# Altium schematic sheet Sheet3.SchDoc
size A3; SheetNumber: 1; SheetTotal: 1
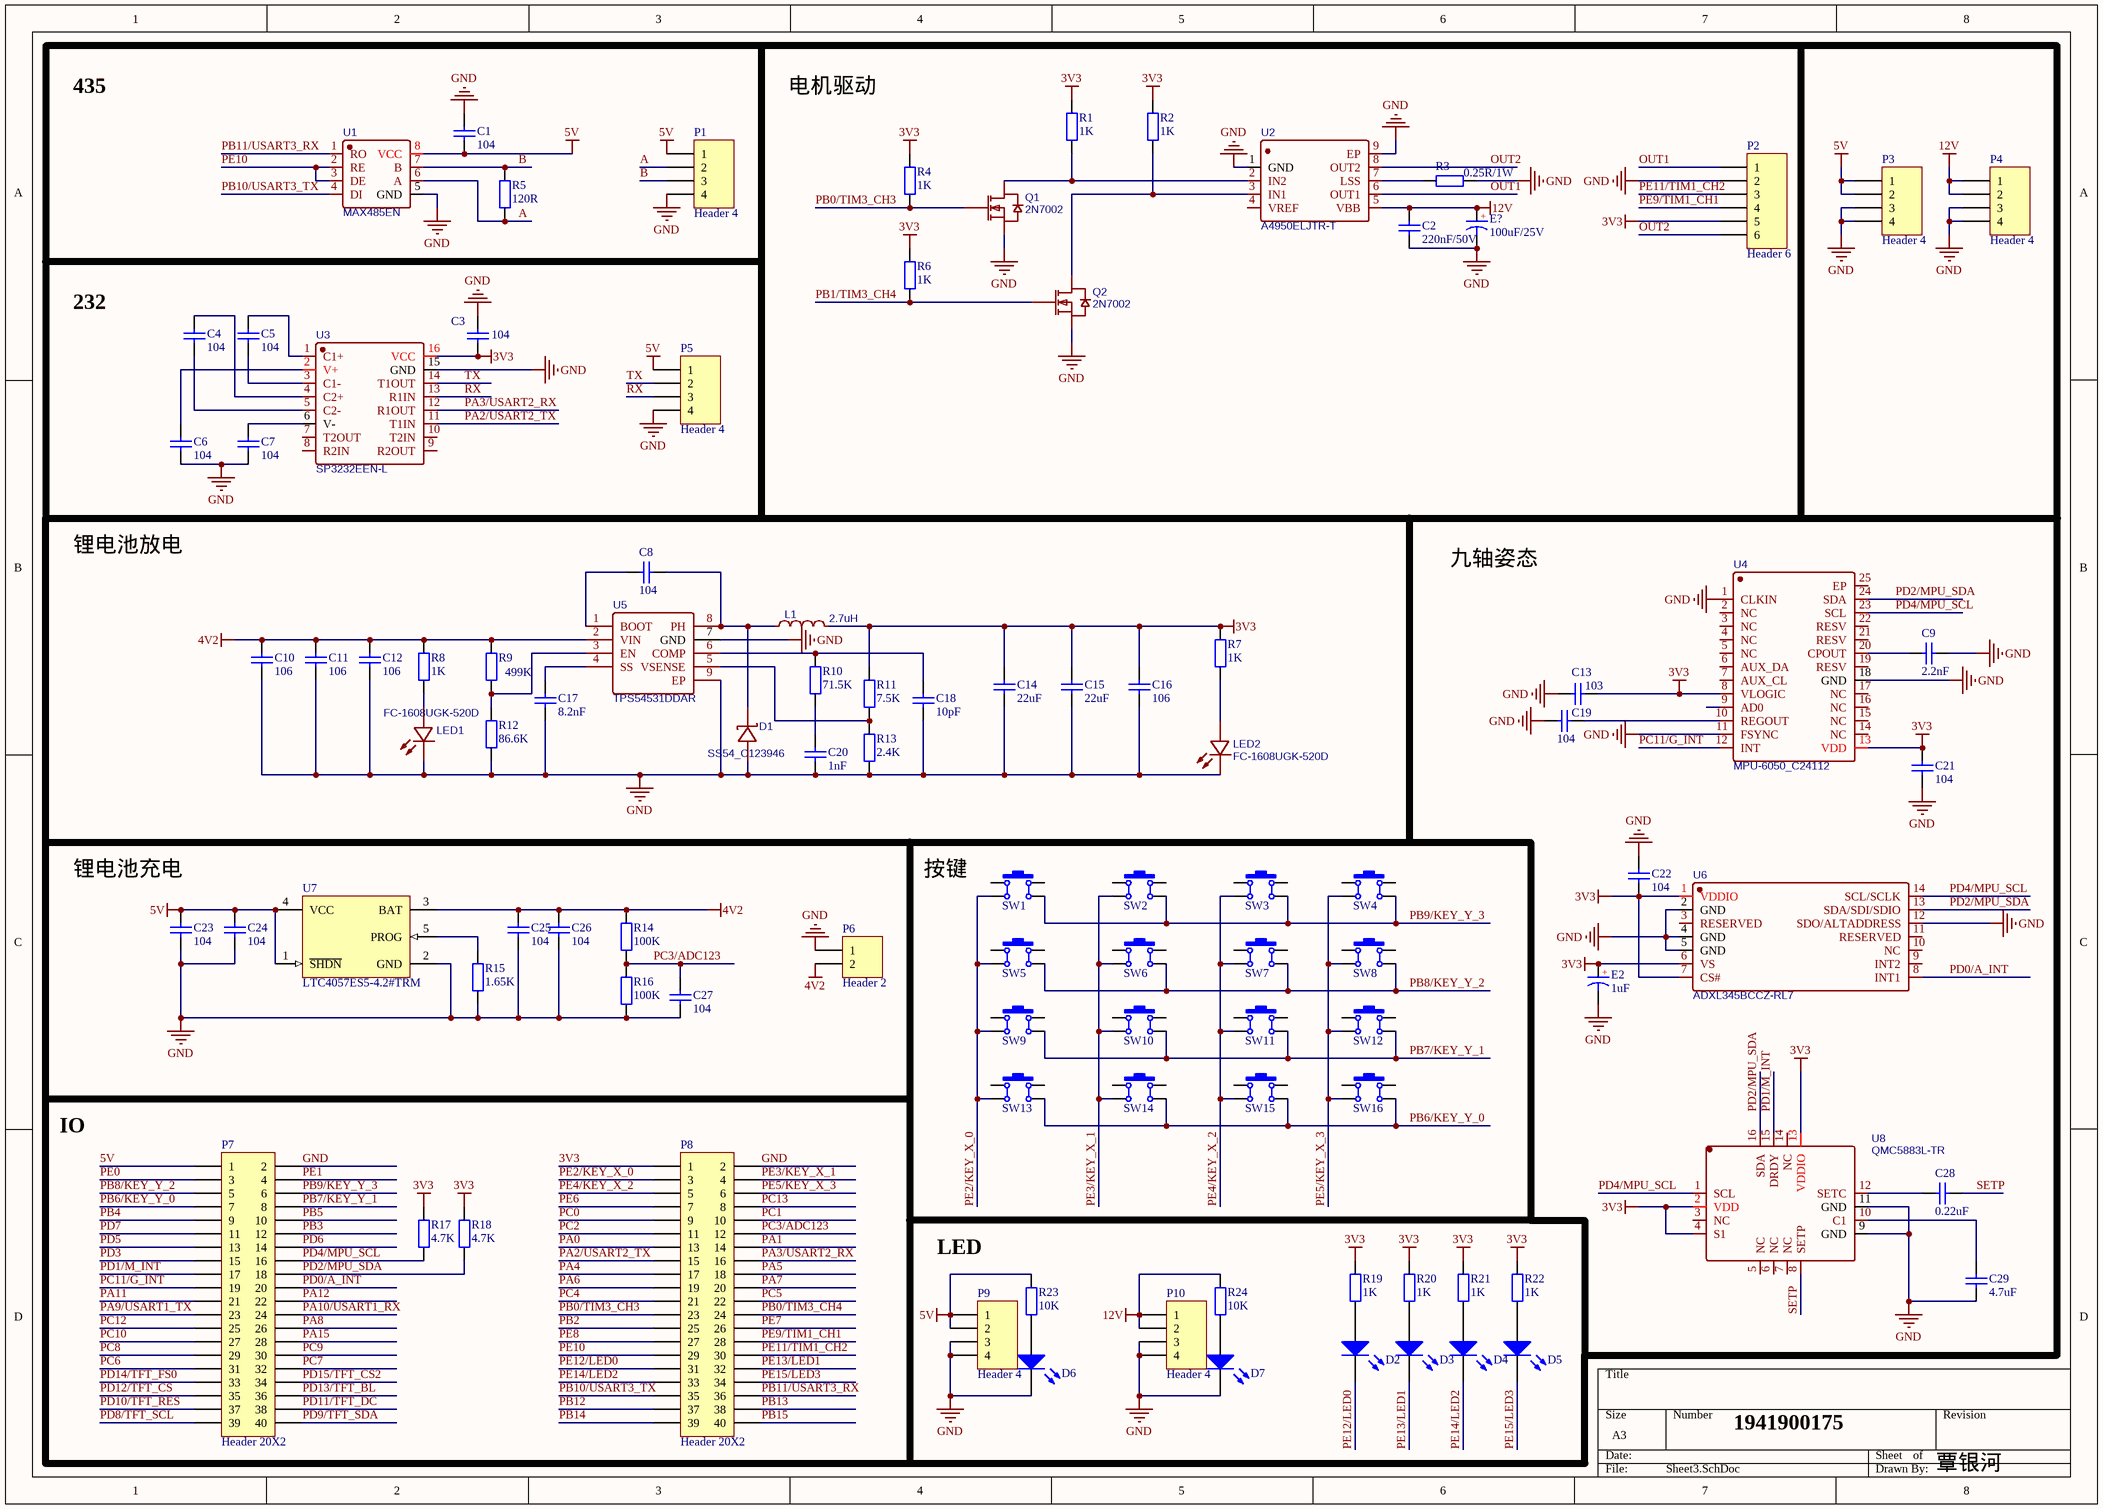
[diagram p0: Sheet3.SchDoc]

## Parts
C1  104  [C0603_M]
C2  220nF/50V  [C0603_M]
C3  104  [C0603_M]
C4  104  [C0603_M]
C5  104  [C0603_M]
C6  104  [C0603_M]
C7  104  [C0603_M]
C8  104  [C0603_M]
C9  2.2nF  [C0805_L]
C10  106  [C0603_M]
C11  106  [C0603_M]
C12  106  [C0603_M]
C13  103  [C0805_L]
C14  22uF  [C0603_M]
C15  22uF  [C0603_M]
C16  106  [C0603_M]
C17  8.2nF  [C0603_M]
C18  10pF  [C0603_M]
C19  104  [C0805_L]
C20  1nF  [C0603_M]
C21  104  [C0805_L]
C22  104  [C0603_M]
C23  104  [C0603_M]
C24  104  [C0603_M]
C25  104  [C0603_M]
C26  104  [C0603_M]
C27  104  [C0603_M]
C28  0.22uF  [C0603_M]
C29  4.7uF  [C0603_M]
D1  SS54_C123946  [SMA_L4.4-W2.8-LS5.4-RD]
D2  LED  [LED0603_R]  (value not drawn)
D3  LED  [LED0603_R]  (value not drawn)
D4  LED  [LED0603_R]  (value not drawn)
D5  LED  [LED0603_R]  (value not drawn)
D6  LED  [LED0603_R]  (value not drawn)
D7  LED  [LED0603_R]  (value not drawn)
E2  1uF  [C_3216]
E?  100uF/25V  [CE D(6.3*7.7)]
L1  2.7uH  [IND-SMD_L6.2-W5.9]
LED1  FC-1608UGK-520D  [LED0603-RD]
LED2  FC-1608UGK-520D  [LED0603-RD]
P1  Header 4  [HDR1X4]
P2  Header 6  [HDR1X6]
P3  Header 4  [HDR1X4]
P4  Header 4  [HDR1X4]
P5  Header 4  [HDR1X4]
P6  Header 2  [HDR1X2]
P7  Header 20X2  [HDR2X20]
P8  Header 20X2  [HDR2X20]
P9  Header 4  [HDR1X4]
P10  Header 4  [HDR1X4]
Q1  2N7002  [SOT-23-3_L2.9-W1.3-P1.90-LS2.4-BR]
Q2  2N7002  [SOT-23-3_L2.9-W1.3-P1.90-LS2.4-BR]
R1  1K  [R0603_M]
R2  1K  [R0603_M]
R3  0.25R/1W  [R0603_M]
R4  1K  [R0603_M]
R5  120R  [R0603_M]
R6  1K  [R0603_M]
R7  1K  [R0603_M]
R8  1K  [R0603_M]
R9  499K  [R0603_M]
R10  71.5K  [R0603_M]
R11  7.5K  [R0603_M]
R12  86.6K  [R0603_M]
R13  2.4K  [R0603_M]
R14  100K  [R0603_M]
R15  1.65K  [R0603_M]
R16  100K  [R0603_M]
R17  4.7K  [R0603_M]
R18  4.7K  [R0603_M]
R19  1K  [R0603_M]
R20  1K  [R0603_M]
R21  1K  [R0603_M]
R22  1K  [R0603_M]
R23  10K  [R0603_M]
R24  10K  [R0603_M]
SW1  6x6x5  [SW DIP-6*6*6]  (value not drawn)
SW2  6x6x5  [SW DIP-6*6*6]  (value not drawn)
SW3  6x6x5  [SW DIP-6*6*6]  (value not drawn)
SW4  6x6x5  [SW DIP-6*6*6]  (value not drawn)
SW5  6x6x5  [SW DIP-6*6*6]  (value not drawn)
SW6  6x6x5  [SW DIP-6*6*6]  (value not drawn)
SW7  6x6x5  [SW DIP-6*6*6]  (value not drawn)
SW8  6x6x5  [SW DIP-6*6*6]  (value not drawn)
SW9  6x6x5  [SW DIP-6*6*6]  (value not drawn)
SW10  6x6x5  [SW DIP-6*6*6]  (value not drawn)
SW11  6x6x5  [SW DIP-6*6*6]  (value not drawn)
SW12  6x6x5  [SW DIP-6*6*6]  (value not drawn)
SW13  6x6x5  [SW DIP-6*6*6]  (value not drawn)
SW14  6x6x5  [SW DIP-6*6*6]  (value not drawn)
SW15  6x6x5  [SW DIP-6*6*6]  (value not drawn)
SW16  6x6x5  [SW DIP-6*6*6]  (value not drawn)
U1  MAX485EN  [DIP-8_L10.0-W6.5-P2.54-LS7.6-BL]
U2  A4950ELJTR-T  [SOIC-8_L4.9-W3.9-P1.27-LS6.0-BL-EP]
U3  SP3232EEN-L  [SOIC-16_L9.9-W3.9-P1.27-LS6.0-BL]
U4  MPU-6050_C24112  [QFN-24_L4.0-W4.0-P0.50-BL-EP2.6]
U5  TPS54531DDAR  [SOIC-8_L5.0-W4.0-P1.27-LS6.0-BL-EP]
U6  ADXL345BCCZ-RL7  [LGA-14_L5.0-W3.0-P0.80-BL]
U7  LTC4057ES5-4.2#TRM  [LT-S5-5-TSOT-23_N]
U8  QMC5883L-TR  [SENSOR-SMD_QMC5883L-TR]

## Nets
3V3: C3.1 C13.2 C14.2 C15.2 C16.2 C21.2 C22.1 E2.1(A) L1.2 P2.5 P8.1 R1.2 R2.2 R4.2 R6.2 R7.2 R11.2 R17.2 R18.2 R19.2 R20.2 R21.2 R22.2 U3.16(VCC) U4.8(VLOGIC) U4.13(VDD) U6.1(VDDIO) U6.6(VS) U6.7(CS#) U8.2(VDD) U8.4(S1) U8.13(VDDIO)
4V2: C10.2 C11.2 C12.2 C25.2 C26.2 P6.2 R8.2 R9.2 R14.2 U5.2(VIN) U7.3(BAT)
5V: C1.1 C23.2 C24.2 P1.1 P3.1 P3.2 P5.1 P7.1 P9.1 P9.2 R23.2 U1.8(VCC) U7.1(~{SHDN}) U7.4(VCC)
12V: C2.2 E?.1 P4.1 P4.2 P10.1 P10.2 R24.2 U2.5(VBB)
GND: C1.2 C2.1 C3.2 C6.2 C7.1 C9.2 C10.1 C11.1 C12.1 C13.1 C14.1 C15.1 C16.1 C17.1 C18.2 C19.1 C20.1 C21.1 C22.2 C23.1 C24.1 C25.1 C26.1 C27.1 C29.1 D1.2(A) D6.2(K) D7.2(K) E2.2(K) E?.2 LED1.1(K) LED2.1(K) P1.4 P2.2 P3.3 P3.4 P4.3 P4.4 P5.4 P6.1 P7.2 P8.2 P9.3 P9.4 P10.3 P10.4 Q1.2(S) Q2.2(S) R3.2 R12.1 R13.1 R15.1 R16.1 U1.5(GND) U2.1(GND) U2.9(EP) U3.15(GND) U4.1(CLKIN) U4.11(FSYNC) U4.18(GND) U5.7(GND) U5.9(EP) U6.2(GND) U6.4(GND) U6.5(GND) U6.12(SDO/ALTADDRESS) U7.2(GND) U8.9(GND) U8.11(GND)
A: P1.2 R5.1 U1.6(A)
B: P1.3 R5.2 U1.7(B)
OUT1: P2.1 U2.6(OUT1)
OUT2: P2.6 U2.8(OUT2)
PA0: P8.13
PA1: P8.14
PA2/USART2_TX: P8.15 U3.11(T1IN)
PA3/USART2_RX: P8.16 U3.12(R1OUT)
PA4: P8.17
PA5: P8.18
PA6: P8.19
PA7: P8.20
PA8: P7.26
PA9/USART1_TX: P7.23
PA10/USART1_RX: P7.24
PA11: P7.21
PA12: P7.22
PA15: P7.28
PB0/TIM3_CH3: P8.23 Q1.1(G) R4.1
PB0/TIM3_CH4: P8.24
PB1/TIM3_CH4: Q2.1(G) R6.1
PB2: P8.25
PB3: P7.12
PB4: P7.9
PB5: P7.10
PB6/KEY_Y_0: P7.7 SW13.3 SW14.3 SW15.3 SW16.3
PB7/KEY_Y_1: P7.8 SW9.3 SW10.3 SW11.3 SW12.3
PB8/KEY_Y_2: P7.5 SW5.3 SW6.3 SW7.3 SW8.3
PB9/KEY_Y_3: P7.6 SW1.3 SW2.3 SW3.3 SW4.3
PB10/USART3_TX: P8.35 U1.4(DI)
PB11/USART3_RX: P8.36 U1.1(RO)
PB12: P8.37
PB13: P8.38
PB14: P8.39
PB15: P8.40
PC0: P8.9
PC1: P8.10
PC2: P8.11
PC3/ADC123: C27.2 P8.12 R14.1 R16.2
PC4: P8.21
PC5: P8.22
PC6: P7.31
PC7: P7.32
PC8: P7.29
PC9: P7.30
PC10: P7.27
PC11/G_INT: P7.19 U4.12(INT)
PC12: P7.25
PC13: P8.8
PD0/A_INT: P7.20 U6.8(INT1)
PD1/M_INT: P7.17 U8.15(DRDY)
PD2/MPU_SDA: P7.18 R18.1 U4.24(SDA) U6.13(SDA/SDI/SDIO) U8.16(SDA)
PD3: P7.15
PD4/MPU_SCL: P7.16 R17.1 U4.23(SCL) U6.14(SCL/SCLK) U8.1(SCL)
PD5: P7.13
PD6: P7.14
PD7: P7.11
PD8/TFT_SCL: P7.39
PD9/TFT_SDA: P7.40
PD10/TFT_RES: P7.37
PD11/TFT_DC: P7.38
PD12/TFT_CS: P7.35
PD13/TFT_BL: P7.36
PD14/TFT_FS0: P7.33
PD15/TFT_CS2: P7.34
PE0: P7.3
PE1: P7.4
PE2/KEY_X_0: P8.3 SW1.4 SW5.4 SW9.4 SW13.4
PE3/KEY_X_1: P8.4 SW2.4 SW6.4 SW10.4 SW14.4
PE4/KEY_X_2: P8.5 SW3.4 SW7.4 SW11.4 SW15.4
PE5/KEY_X_3: P8.6 SW4.4 SW8.4 SW12.4 SW16.4
PE6: P8.7
PE7: P8.26
PE8: P8.27
PE9/TIM1_CH1: P2.4 P8.28
PE10: P8.29 U1.2(RE) U1.3(DE)
PE11/TIM1_CH2: P2.3 P8.30
PE12/LED0: D2.2(K) P8.31
PE13/LED1: D3.2(K) P8.32
PE14/LED2: D4.2(K) P8.33
PE15/LED3: D5.2(K) P8.34
RX: P5.3 U3.13(R1IN)
SETP: C28.2 U8.8(SETP)
TX: P5.2 U3.14(T1OUT)
NetC4_1: C4.1 U3.5(C2-)
NetC4_2: C4.2 U3.4(C2+)
NetC5_1: C5.1 U3.3(C1-)
NetC5_2: C5.2 U3.1(C1+)
NetC6_1: C6.1 U3.2(V+)
NetC7_2: C7.2 U3.6(V-)
NetC8_1: C8.1 U5.1(BOOT)
NetC8_2: C8.2 D1.1(K) L1.1 U5.8(PH)
NetC9_1: C9.1 U4.20(CPOUT)
NetC17_2: C17.2 U5.4(SS)
NetC18_1: C18.1 R10.2 U5.6(COMP)
NetC19_2: C19.2 U4.10(REGOUT)
NetC20_2: C20.2 R10.1
NetC28_1: C28.1 U8.12(SETC)
NetC29_2: C29.2 U8.10(C1)
NetD2_1: D2.1(A) R19.1
NetD3_1: D3.1(A) R20.1
NetD4_1: D4.1(A) R21.1
NetD5_1: D5.1(A) R22.1
NetD6_1: D6.1(A) R23.1
NetD7_1: D7.1(A) R24.1
NetLED1_2: LED1.2(A) R8.1
NetLED2_2: LED2.2(A) R7.1
NetQ1_3: Q1.3(D) R1.1 U2.2(IN2)
NetQ2_3: Q2.3(D) R2.1 U2.3(IN1)
NetR3_1: R3.1 U2.7(LSS)
NetR9_1: R9.1 R12.2 U5.3(EN)
NetR11_1: R11.1 R13.2 U5.5(VSENSE)
NetR15_2: R15.2 U7.5(PROG)

Not connected (* = marked no-connect by the designer): SW1 1 2; SW2 1 2; SW3 1 2; SW4 1 2; SW5 1 2; SW6 1 2; SW7 1 2; SW8 1 2; SW9 1 2; SW10 1 2; SW11 1 2; SW12 1 2; SW13 1 2; SW14 1 2; SW15 1 2; SW16 1 2; U2 4(VREF); U3 7(T2OUT) 8(R2IN) 9(R2OUT) 10(T2IN); U4 2(NC) 3(NC) 4(NC) 5(NC) 6(AUX_DA) 7(AUX_CL) 9(AD0) 14(NC) 15(NC) 16(NC) 17(NC) 19(RESV) 21(RESV) 22(RESV) 25(EP); U6 3(RESERVED) 9(INT2) 10(NC) 11(RESERVED); U8 3(NC) 5(NC) 6(NC) 7(NC) 14(NC)

## Notes on the sheet
- 435
- 电机驱动
- 232
- 锂电池放电
- 九轴姿态
- 锂电池充电
- 按键
- IO
- LED
- 1941900175
- 覃银河
- (in symbol CE_SMD) +
- (in symbol CT) +

## Library data of the parts
C1-C29 = C: 贴片电容; BOM名称: 无极性贴片电容; 联系卖家，免费查找封装: 唯一出售店铺网址https://shop463601444.taobao.com
D1 = SS54_C123946: BOM_Manufacturer: Jingdao; BOM_Manufacturer Part: SS54; Contributor: LCSC; BOM_Supplier: LCSC; BOM_Supplier Part: C123946; BOM_JLCPCB Part Class: Extended Part; JLCPCB Part Class: Extended Part; spicePre: D; spiceSymbolName: SS54_C123946
D2-D7 = LED: 发光二极管; 封装库来自淘宝卖家 ID：黄晶宝石: 其他店铺购入均为假冒，请立即申请退款，本店奖励现金5~20元
E2 = CT: 贴片钽电容; 联系卖家，免费查找封装: 唯一出售店铺网址https://shop463601444.taobao.com; 封装库来自淘宝卖家ID：黄晶宝石: 其他店铺购入均为盗版假冒封装库，请立即申请退款; BOM名称: 贴片钽电容
E? = CE_SMD: 贴片电解电容; 联系卖家，免费查找封装: 唯一出售店铺网址https://shop463601444.taobao.com; 封装库来自淘宝卖家ID：黄晶宝石: 其他店铺购入均为盗版假冒封装库，请立即申请退款; BOM名称: 贴片电解电容
L1 = 3.3uH: BOM_Manufacturer: TDK; BOM_Manufacturer Part: CLF6045T-3R3N-D; nameAlias: Inductance; Contributor: LCSC; BOM_Supplier: LCSC; BOM_Supplier Part: C432958; spicePre: L; spiceSymbolName: CLF6045T-3R3N-D
LED1 LED2 = FC-1608UGK-520D: BOM_Manufacturer: NATIONSTAR; BOM_Supplier: LCSC; BOM_Manufacturer Part: FC-1608UGK-520D; BOM_Supplier Part: C87326; spicePre: L; spiceSymbolName: FC-1608UGK-520D
P1 P3-P5 P9 P10 = Header 4: Header, 4-Pin; LatestRevisionDate: 17-Jul-2002; LatestRevisionNote: Re-released for DXP Platform.; Publisher: Altium Limited
P2 = Header 6: Header, 6-Pin; LatestRevisionDate: 17-Jul-2002; LatestRevisionNote: Re-released for DXP Platform.; Publisher: Altium Limited
P6 = Header 2: Header, 2-Pin; LatestRevisionDate: 17-Jul-2002; LatestRevisionNote: Re-released for DXP Platform.; Publisher: Altium Limited
P7 P8 = Header 20X2: Header, 20-Pin, Dual row; LatestRevisionDate: 17-Jul-2002; LatestRevisionNote: Re-released for DXP Platform.; Publisher: Altium Limited
Q1 Q2 = 2N7002: BOM_Manufacturer: CJ; BOM_Supplier: LCSC; BOM_Manufacturer Part: 2N7002; BOM_Supplier Part: C8545; BOM_JLCPCB Part Class: Basic Part; spicePre: Q; spiceSymbolName: 2N7002
R1-R24 = R: 贴片电阻; 联系卖家，免费查找封装: 唯一出售店铺网址https://shop463601444.taobao.com; 封装库来自淘宝卖家ID：黄晶宝石: 其他店铺购入均为盗版假冒封装库，请立即申请退款; BOM名称: 贴片电阻
SW1-SW16 = TSW DIP-6x6: 直插6x6轻触开关; 联系卖家，免费查找封装: 唯一出售店铺网址https://shop463601444.taobao.com; BOM名称: 直插6x6轻触开关
U1 = MAX485EN: BOM_Manufacturer: HTC Korea TAEJIN Tech; Contributor: LCSC; BOM_Supplier: LCSC; BOM_Supplier Part: C481665; BOM_Manufacturer Part: MAX485EN; spicePre: U; spiceSymbolName: MAX485EN
U2 = A4950ELJTR-T: BOM_Manufacturer: ALLEGRO; BOM_Supplier: LCSC; BOM_Manufacturer Part: A4950ELJTR-T; BOM_Supplier Part: C82404; BOM_JLCPCB Part Class: Extended Part; spicePre: U; spiceSymbolName: A4950ELJTR-T
U3 = SP3232EEN-L: BOM_Manufacturer: MaxLinear; Contributor: LCSC; BOM_Supplier: LCSC; BOM_Supplier Part: C442458; BOM_Manufacturer Part: SP3232EEN-L; spicePre: U; spiceSymbolName: SP3232EEN-L
U4 = MPU-6050_C24112: BOM_Manufacturer: InvenSense; sourceId: 1T5FDZYC8; timeStamp: 1462265206; BOM_Supplier: LCSC; BOM_Manufacturer Part: MPU-6050; BOM_Supplier Part: C24112; BOM_JLCPCB Part Class: Basic Part; spicePre: U; spiceSymbolName: MPU-6050_C24112
U5 = TPS54531DDAR: BOM_Manufacturer: TI; BOM_Supplier: LCSC; BOM_Manufacturer Part: TPS54531DDAR; BOM_Supplier Part: C50605; BOM_JLCPCB Part Class: Extended Part; JLCPCB Part Class: Extended Part; spicePre: U; spiceSymbolName: TPS54531DDAR
U6 = ADXL345BCCZ-RL7: BOM_Manufacturer: ADI; BOM_Supplier: LCSC; BOM_Manufacturer Part: ADXL345BCCZ-RL7; BOM_Supplier Part: C9667; BOM_JLCPCB Part Class: Extended Part; spicePre: U; spiceSymbolName: ADXL345BCCZ-RL7
U7 = LTC4057ES5-4.2#TRM: Linear Li-Ion Battery Charger with Thermal Regulation, 4.25 to 6.5 V Vin, 5-pin SOT23 (S5-5), -40 to 85 degC, Mini Tape and Reel; Manufacturer: Linear Technology; Battery Chemistry: Li-Ion, Li-Polymer; Charge Termination: Microcontroller; Float Voltage: 4.2 V; Max Charge Current(A): 0.8; Number of Cells: 1; Vin Max(V): 6.5; Vin Min(V): 4.25; PackageVersion: Jun-10; PackageReference: S5-5; PackageDescription: 5-Pin Plastic TSOT-23, Body 1.63 x 2.90 mm, Pitch 0.95 mm; Supplier 1: Digi-Key; Supplier Part Number 1: LTC4057ES5-4.2#TRM-ND; Packing: Mini Tape and Reel; RoHS: FALSE; Type of Charger: Linear; Mounting Technology: Surface Mount; Code_JEDEC: MO-193; PartNumber: LTC4057ES5-4.2#TRM; ComponentLink1Description: Manufacturer URL; ComponentLink1URL: http://www.linear.com/; ComponentLink2Description: Datasheet; ComponentLink2URL: http://cds.linear.com/docs/en/datasheet/4057f.pdf; ComponentLink3Description: Package Specification; ComponentLink3URL: http://cds.linear.com/docs/en/packaging/SOT_5_05-08-1635.pdf
U8 = QMC5883L-TR: BOM_Manufacturer: QST; Contributor: LCSC; BOM_Supplier: LCSC; BOM_Supplier Part: C192585; BOM_Manufacturer Part: QMC5883L-TR; BOM_JLCPCB Part Class: Extended Part; spicePre: U; spiceSymbolName: QMC5883L-TR